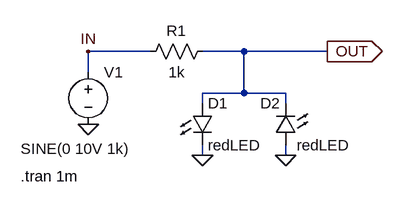
[diagram p0: schematic LED_Limiter.asc]
LED_Limiter.asc, the LTspice schematic file:
Version 4
SHEET 1 880 680
WIRE 128 80 32 80
WIRE 272 80 208 80
WIRE 400 80 272 80
WIRE 32 112 32 80
WIRE 272 144 272 80
WIRE 272 144 208 144
WIRE 336 144 272 144
WIRE 208 160 208 144
WIRE 336 160 336 144
WIRE 208 240 208 224
WIRE 336 240 336 224
FLAG 400 80 OUT
IOPIN 400 80 Out
FLAG 32 192 0
FLAG 208 240 0
FLAG 336 240 0
FLAG 32 80 IN
SYMBOL voltage 32 96 R0
WINDOW 3 -104 134 Left 2
WINDOW 123 0 0 Left 2
WINDOW 39 0 0 Left 2
SYMATTR Value SINE(0 10V 1k)
SYMATTR InstName V1
SYMBOL LED 192 160 R0
SYMATTR InstName D1
SYMATTR Value redLED
SYMBOL LED 352 224 R180
WINDOW 0 24 64 Left 2
WINDOW 3 -83 0 Left 2
SYMATTR InstName D2
SYMATTR Value redLED
SYMBOL res 224 64 R90
WINDOW 0 0 56 VBottom 2
WINDOW 3 32 56 VTop 2
SYMATTR InstName R1
SYMATTR Value 1k
TEXT -72 272 Left 2 !.tran 1m

The netlist it stands for:
* LED_Limiter.asc
V1 IN 0 SINE(0 10V 1k)
D1 OUT 0 redLED
D2 0 OUT redLED
R1 OUT IN 1k
.model D D
.lib standard.dio
.tran 1m
.backanno
.end